# Altium schematic sheet Supply.SchDoc
size A4; SheetNumber: 6; SheetTotal: 7
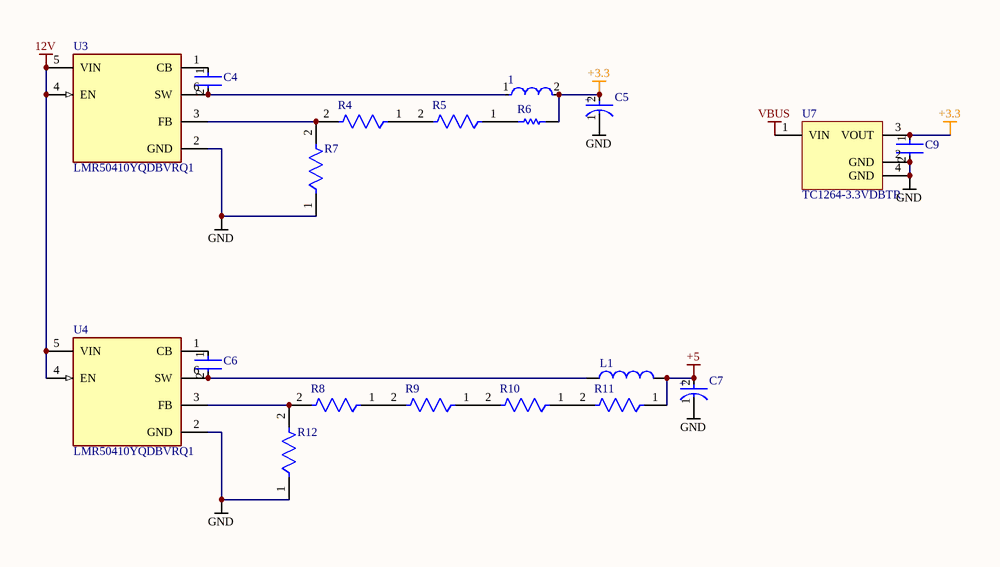
[diagram p0: Supply.SchDoc]

## Parts
1  LQM2HPN3R3MGCL  [FP-LQM2HPN_G0-IPC_B]  (value not drawn)
C4  GRM033R60J104KE19D  [FP-GRM033-0_03-MFG]  (value not drawn)
C5  EEE1VA100SR  [FP-SC-MFG]  (value not drawn)
C6  GRM033R60J104KE19D  [FP-GRM033-0_03-MFG]  (value not drawn)
C7  EEE1VA100SR  [FP-SC-MFG]  (value not drawn)
C9  GRM033R60J104KE19D  [FP-GRM033-0_03-MFG]  (value not drawn)
L1  74479887247A  [WE-PMI_1008_L2.5W2H1]  (value not drawn)
R4  ERA2AEB223X  [FP-ERA2A-IPC_A]  (value not drawn)
R5  ERA2AEB223X  [FP-ERA2A-IPC_A]  (value not drawn)
R6  RC0603FR-076K8L  [RESC1608X55X25ML10T15]  (value not drawn)
R7  ERA2AEB223X  [FP-ERA2A-IPC_A]  (value not drawn)
R8  ERA2AEB223X  [FP-ERA2A-IPC_A]  (value not drawn)
R9  ERA2AEB223X  [FP-ERA2A-IPC_A]  (value not drawn)
R10  ERA2AEB223X  [FP-ERA2A-IPC_A]  (value not drawn)
R11  ERA2AEB223X  [FP-ERA2A-IPC_A]  (value not drawn)
R12  ERA2AEB223X  [FP-ERA2A-IPC_A]  (value not drawn)
U3  LMR50410YQDBVRQ1  [FP-DBV0006A-MFG]
U4  LMR50410YQDBVRQ1  [FP-DBV0006A-MFG]
U7  TC1264-3.3VDBTR  [SOT-223-DB3_N]

## Nets
12V: U3.4(EN) U3.5(VIN) U4.4(EN) U4.5(VIN)
+3.3: 1.2 C5.2(A) C9.1 R6.2 U7.3(VOUT)
+5: C7.2(A) L1.2 R11.1
GND: C5.1(C) C7.1(C) C9.2 R7.1 R12.1 U3.2(GND) U4.2(GND) U7.2(GND) U7.4(GND)
VBUS: U7.1(VIN)
Net1_1: 1.1 C4.2 U3.6(SW)
NetC4_1: C4.1 U3.1(CB)
NetC6_1: C6.1 U4.1(CB)
NetC6_2: C6.2 L1.1 U4.6(SW)
NetR4_1: R4.1 R5.2
NetR4_2: R4.2 R7.2 U3.3(FB)
NetR5_1: R5.1 R6.1
NetR8_1: R8.1 R9.2
NetR8_2: R8.2 R12.2 U4.3(FB)
NetR9_1: R9.1 R10.2
NetR10_1: R10.1 R11.2

## Notes on the sheet
- (in symbol CMP-05427-000087-1) +

## Library data of the parts
1 = CMP-06042-016451-1: Multilayer Type Inductor for Power Lines, 1008 (2520), 3.3μH, 20%, 0.2Ω, 1000mA; Max DC Current: 1A; Shielding: Shielded; Test Frequency: 1MHz; DC Resistance (DCR): 200mR; Self Resonant Frequency: 30MHz; Inductance: 3.3uH; Core Material: Ferrite; Case/Package: 1008; Height: 0.9mm; Series: LQM2HP_GC; Case Code (Metric): 2520; Package Quantity: 3000; Current Rating: 1A; Max Operating Temperature: 125°C; Lead Free: Lead Free; Width: 0.079inch; Min Operating Temperature: -55°C; Mount: Surface Mount; Tolerance: 20%; Height - Seated (Max): 0.039inch; Depth: 2.2mm; RoHS Compliant: Yes; Termination: SMD/SMT; Radiation Hardening: No; Length: 2.5mm; Case Code (Imperial): 1008; Packaging: Tape and Reel
C4 C6 C9 = CMP-06035-000062-2: Chip Multilayer Ceramic Capacitors for General Purpose, 0201, 0.10uF, X5R, 15%, 10%, 6.3V; Capacitance: 100nF; Min Operating Temperature: -55°C; Lead Free: Lead Free; Radiation Hardening: No; Dielectric: X5R; Voltage Rating (DC): 6.3V; REACH SVHC: No SVHC; Case/Package: 0201; Voltage Rating: 6.3V; Length: 0.6mm; Max Operating Temperature: 85°C; Width: 0.012inch; Depth: 0.3mm; Material: Ceramic; Case Code (Metric): 0603; Thickness: 0.013inch; Packaging: Tape and Reel; Height: 0.3mm; Weight: 6E-06oz; Package Quantity: 1; Mount: Surface Mount; Voltage: 6.3V; Case Code (Imperial): 0201; Tolerance: 10%; Termination: SMD/SMT
C5 C7 = CMP-05427-000087-1: CAP ALUM 10UF 20% 35V SMD; Life (Hours): 2000Hour; Lead Length: 2.2mm; Ripple Current (AC): 30mA; Leakage Current: 3uA; Length: 5.5mm; Construction: Cylindrical; Diameter: 5mm; RoHS Compliant: Yes; REACH SVHC: No SVHC; Capacitance: 10uF; Max Operating Temperature: 85°C; Series: S; Case/Package: Radial; Contact Plating: Tin; Packaging: Tape and Reel; Voltage Rating: 35V; Number of Pins: 2; Height: 5.4mm; Width: 5.3mm; Voltage Rating (DC): 35V; Mount: Surface Mount; Tolerance: 20%; Lead Pitch: 1.5mm; Radiation Hardening: No; Height - Seated (Max): 0.213inch; Ripple Current: 30mA; Voltage: 35V; Package Quantity: 1; Termination: SMD/SMT; Min Operating Temperature: -40°C
L1 = CMP-1392-00007-2: NexarPartId: 29436167; DC Resistance (DCR): 230mΩ; Q Factor: 23; Inductance Tolerance: 20%; Max DC Current: 1A; Self Resonant Frequency: 45MHz; Inductance: 4.7µH; Test Frequency: 1MHz; Core Material: Ferrite; Saturation Current: 400mA; Shielding: Shielded; REACH SVHC: Unknown; Number of Pins: 2; Mount: Surface Mount; Tolerance: 20%; Min Operating Temperature: -40°C; Packaging: Digi-Reel®; Lead Free: Lead Free; Resistance: 230MΩ; Ambient Temperature Range High: 85°C; Ambient Temperature Range Low: -40°C; Case Code (Imperial): 1008; Current Rating: 1A; Width: 2mm; Max Operating Temperature: 125°C; Height: 800µm; RoHS: Compliant; Length: 2.5mm; Case/Package: SMD/SMT; Termination: SMD/SMT; Height - Seated (Max): 990.6µm; Case Code (Metric): 2520
R4 R5 R7-R12 = CMP-2002-05882-2: RES SMD 22K OHM 0.1% 1/16W 0402; Power Rating: 62.5mW; Voltage Rating: 50V; Temperature Coefficient: 25ppm/°C; Voltage Rating (DC): 25V; Resistance: 22kR; Max Power Dissipation: 63mW; Length: 1mm; Contact Plating: Tin; RoHS Compliant: Yes; Max Operating Temperature: 155°C; Termination: SMD/SMT; Depth: 0.5mm; Height: 0.35mm; Technology: THIN FILM; REACH SVHC: No SVHC; Width: 0.5mm; Mount: Surface Mount; Radiation Hardening: No; Min Operating Temperature: -55°C; Case Code (Metric): 1005; Packaging: Cut Tape; Weight: 2.8E-05oz; Package Quantity: 10000; Number of Terminations: 2; Series: ERA-xA; Number of Pins: 2; Military Standard: Not; Tolerance: 0.1%; Resistor Type: Metal Film; Lead Free: Lead Free; Case/Package: 0402; Case Code (Imperial): 0402; Features: Automotive AEC-Q200
R6 = CMP-1659-00046-1: Chip Resistor, 6.8 KOhm, +/- 1%, 100 mW, -55 to 155 degC, 0603 (1608 Metric), RoHS, Tape and Reel; Shielding: Unshielded; Gender: Female; Current Rating: 2 A; Case\Package: Metal; Voltage Rating: 34 V; Colour: Black; ComponentLink2URL: http://www.yageo.com/documents/recent/PYu-RC_Group_51_RoHS_L_04.pdf; REACH SVHC: Unknown; Package Quantity: 1; Height: 13 mm; Contact Material: Copper; ComponentLink1Description: Manufacturer URL; Min Operating Temperature: -25 degC; RoHSCompliant: true; ComponentLink2Description: Datasheet; PackageReference: 0603; Length: 19.5 mm; Pins: 1; Contact Plating: Silver; PackageDescription: 2-Pin Surface Mount Device, Body 1.6 x 0.8 mm; Max Operating Temperature: 85 degC; Mount: Through Hole; DatasheetVersion: Rev. 4, 02/2016; Width: 10 mm; ComponentLink1URL: http://www.yageo.com/
U3 U4 = CMP-04918-000478-1: NIXON PLUS-LMR50410YQDBVRQ1
U7 = CMP-0136-00429-1: 800 mA Fixed-Output CMOS LDO with Shutdown, 3-Pin SOT-223, Extended Temperature, Tape and Reel; PackageVersion: revBB, Aug-2009; PackageDescription: 3-Lead Plastic Small Outline Transistor (DB) [SOT-223]; PackageReference: SOT-223-DB3; DatasheetVersion: revC, Oct-2006